# EAGLE schematic FNR v1.4 + Speed v1.3 (EAGLE 6.3)
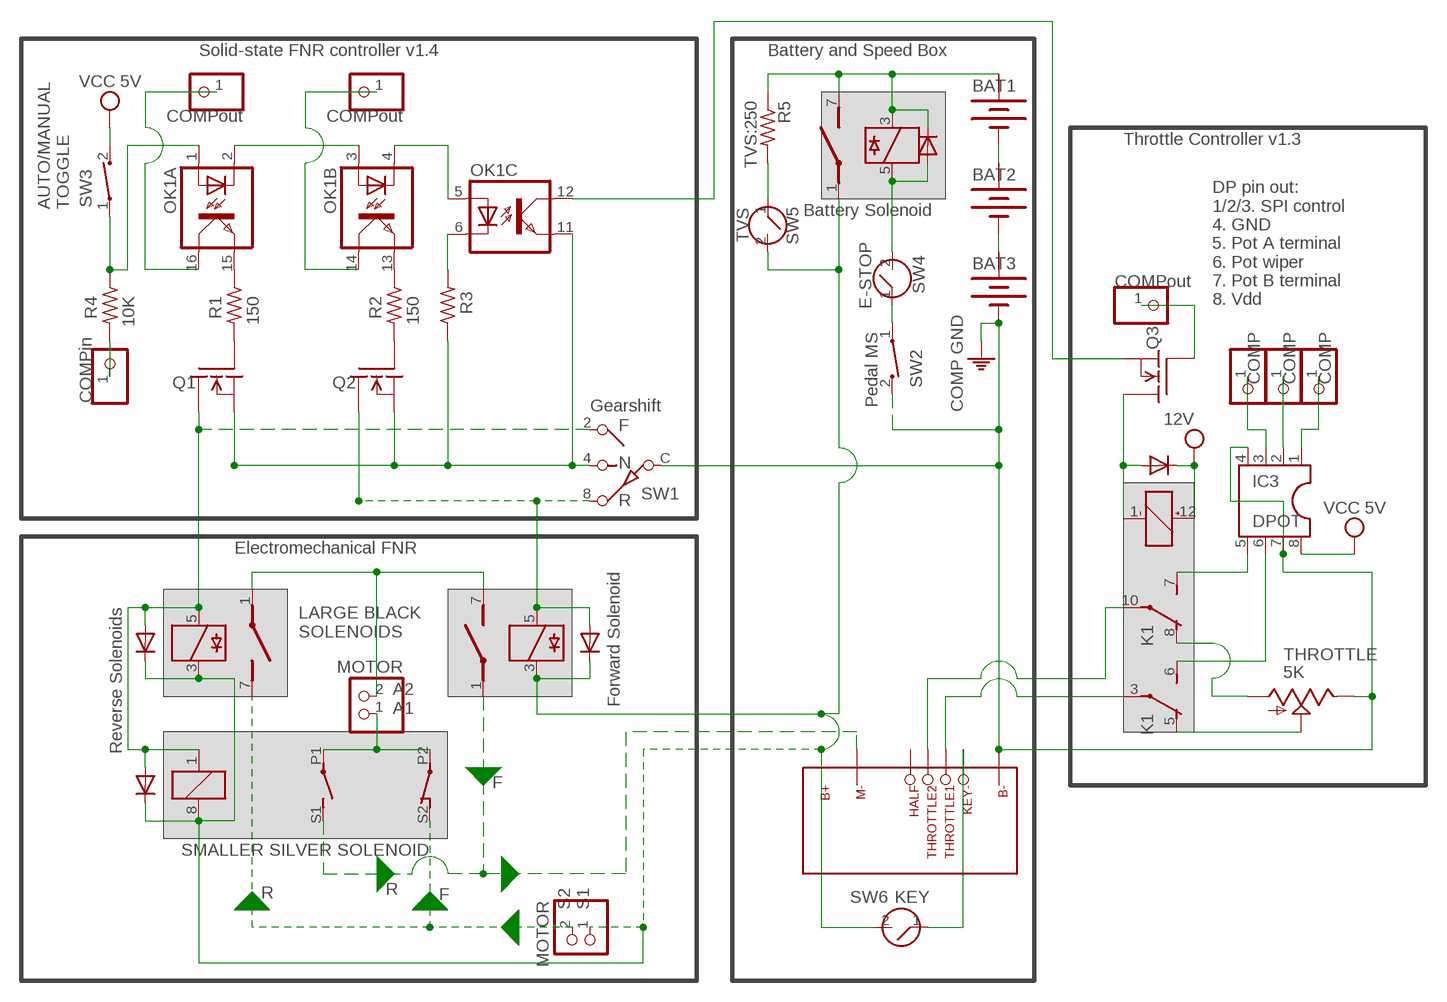
[diagram p0: schematic, sheet 1]

## Parts
BAT1  BATTERY  [BATTERY]
BAT2  BATTERY  [BATTERY]
BAT3  BATTERY  [BATTERY]
D12  1N4004  [DO41-10]
D13  1N4004  [DO41-10]
D14  1N4004  [DO41-10]
D15  1N4004  [DO41-10]
D16  1N4004  [DO41-10]
IC3  DPOT  DIL8  [DIL08]
JP29  MOTOR  PINHD-1X2  [1X02]
JP30  MOTOR  PINHD-1X2  [1X02]
JP31  COMPin  PINHD-1X1  [1X01]
JP32  COMPout  PINHD-1X1  [1X01]
JP33  COMPout  PINHD-1X1  [1X01]
JP34  COMP  PINHD-1X1  [1X01]
JP35  COMP  PINHD-1X1  [1X01]
JP36  COMP  PINHD-1X1  [1X01]
JP37  COMPout  PINHD-1X1  [1X01]
K1  DF2-L-DC24V  [DF2]
K2  35701331  [REED]
K3  35701331  [REED]
K4  G6C-2117P  [G6C-2117P]
K5  35701331  [REED]
OK1  TLP283-4  [MINI-FLAT-16]
Q1  BUZ11  [TO220]
Q2  BUZ11  [TO220]
Q3  BUZ11  [TO220]
R1  150  R-US_0204/5  [0204/5]
R2  150  R-US_0204/5  [0204/5]
R3  R-US_0204/5  [0204/5]
R4  10K  R-US_0204/5  [0204/5]
R5  TVS:250  R-US_0204/5  [0204/5]
SW1  SW-1P3T  [SW-C10]
SW2  Pedal MS  CT10-XXXX-A2  [CT10-XXXX-A2]
SW3  Pedal MS  CT10-XXXX-A2  [CT10-XXXX-A2]
SW4  E-STOP  SWITCH  [SWITCH]
SW5  TVS  SWITCH  [SWITCH]
SW6  KEY  SWITCH  [SWITCH]
THROTTLE  5K  TRIM_US-CT6  [CT6]
U$5  MOTOR-CONTROLLER  [MOTOR-CONTROLLER]

## Nets
A3: JP29.2 K2.1(2:P) K3.7(2:S)
A4: JP29.1 K4.P1(2:P) K4.P2(3:P)
B+: BAT1.+ D12.C D13.C D14.C D16.C JP30.1 JP30.2 K2.3 K2.7(2:S) K3.3 K4.8 K4.S2(3:O) K5.1(2:P) K5.3 K5.7(2:S) R5.1 R5.2 SW5.1 SW5.2 SW6.2 U$5.P$2(B+)
B-: OK1.11(C:EMIT) Q1.3(S) Q2.3(S) R3.1 SW1.4
FGND1: D14.A K3.5 Q2.2(D) SW1.8
M-1: K3.1(2:P) K4.S1(2:S) U$5.P$3(M-)
N$1: D16.A K5.5 SW4.2
N$2: K1.10(3:P) U$5.P$6(THROTTLE2)
N$3: SW2.1 SW4.1
N$4: OK1.12(C:COL) Q3.3(S)
N$5: OK1.2(A:C) OK1.3(B:A)
N$6: OK1.4(B:C) OK1.5(C:A)
N$7: OK1.15(A:EMIT) R1.1
N$8: OK1.13(B:EMIT) R2.1
N$9: OK1.1(A:A) R4.1 SW3.1
N$10: JP33.1 OK1.16(A:COL)
N$11: OK1.6(C:C) R3.2
N$12: JP32.1 OK1.14(B:COL)
N$102: BAT1.- BAT2.+
N$104: BAT2.- BAT3.+
N$105: SW6.1 U$5.P$4(KEY-)
N$108: Q1.1(G) R1.2
N$109: Q2.1(G) R2.2
N$110: JP31.1 R4.2
N$111: K1.3(2:P) U$5.P$5(THROTTLE1)
N$113: K1.5(2:O) THROTTLE.S
N$114: IC3.5 K1.7(3:S)
N$115: IC3.6 K1.6(2:S)
N$116: K1.8(3:O) THROTTLE.A
N$117: IC3.2 JP35.1
N$118: IC3.1 JP36.1
N$119: IC3.3 JP34.1
N$120: D15.A K1.1(1:-) Q3.2(D)
N$121: JP37.1 Q3.1(G)
PE: BAT3.- IC3.4 IC3.7 SW1.C SW2.2 THROTTLE.E U$5.P$1(B-) ; supply symbol labelled COMP GND
RGND1: D12.A D13.A K2.5 K4.1 Q1.2(D) SW1.2
VCC: D15.C IC3.8 K1.12(1:+) SW3.2 ; supply symbol labelled VCC 5V, 12V
Unconnected: OK1.7(D:A) OK1.8(D:C) OK1.9(D:EMIT) OK1.10(D:COL) U$5.P$7(HALF)

## Notes on the sheet
- Solid-state FNR controller v1.4 | Battery and Speed Box
- Throttle Controller v1.3
- AUTO/MANUAL
  TOGGLE
- Battery Solenoid
- DP pin out:
  1/2/3. SPI control
  4. GND
  5. Pot A terminal
  6. Pot wiper
  7. Pot B terminal
  8. Vdd
- Gearshift
- F
  
  N
  
  R
- Electromechanical FNR
- Forward Solenoid
- Reverse Solenoids
- LARGE BLACK
  SOLENOIDS
- A2
  A1
- F
- SMALLER SILVER SOLENOID
- S2
  S1
- R | R
- F

## Power pins joined to a net without a drawn wire
+: BAT1.+@1(+) BAT2.+@1(+) BAT3.+@1(+)

## Library data of the parts
BAT1-BAT3 = special:BATTERY: BATTERY
D12-D16 = adafruit:1N4004: DIODE General purpose 1N400x type rectifier (With bigger pads) http://www.ladyada.net/library/pcb/eaglelibrary.html
IC3 = ic-package:DIL8: Dual In Line / Socket
JP29 JP30 = pinhead:PINHD-1X2: PIN HEADER
JP31-JP37 = adafruit:PINHD-1X1: Pin header 1x1 for 0.1" spacing With round pins
K1 = relay:DF2-?DC*: HIGHLY SENSITIVE DIP MINIATURE RELAY NAiS Single side stable / 1 coil latching Source: http://www.mew-europe.com/.. en_ds_61002_0000.pdf; OC_FARNELL: unknown; OC_NEWARK: unknown
K2 K3 K5 = relay:35701331: RELAY reed, 1 x norm. open with polarity; OC_FARNELL: unknown; OC_NEWARK: unknown
K4 = relay:G6C-2117P: RELAY 1 x norm. open, 1x norm. closed, 10 A/240 V, Omron; OC_FARNELL: unknown; OC_NEWARK: unknown
OK1 = optocoupler:TLP283-4: TOSHIBA PHOTOCOUPLER GaAs IRED & PHOTO-TRANSISTOR Source: http://www.semicon.toshiba.co.jp/td/en/Opto/Photocoupler/en_20050928_TLP283_datasheet.pdf; OC_FARNELL: unknown; OC_NEWARK: unknown
Q1-Q3 = transistor-fet:BUZ11: N-Channel Enhancement MOSFET 50V; 30A; 0,040Ohm
R1-R5 = rcl:R-US_: RESISTOR, American symbol
SW1 = custom:SW-1P3T: SWITCH 3 position switch 1P3T
SW2 SW3 = switch-coto:CT10-XXXX-: CT10 Series Molded Switch Source: www.cotorelay.com .. Coto_Technology__CT10-1530-G1.pdf
SW4-SW6 = custom:SWITCH: Push button switch
THROTTLE = pot:TRIM_US-: POTENTIOMETER
U$5 = custom:MOTOR-CONTROLLER